# Altium schematic sheet peripheral.SchDoc
size A
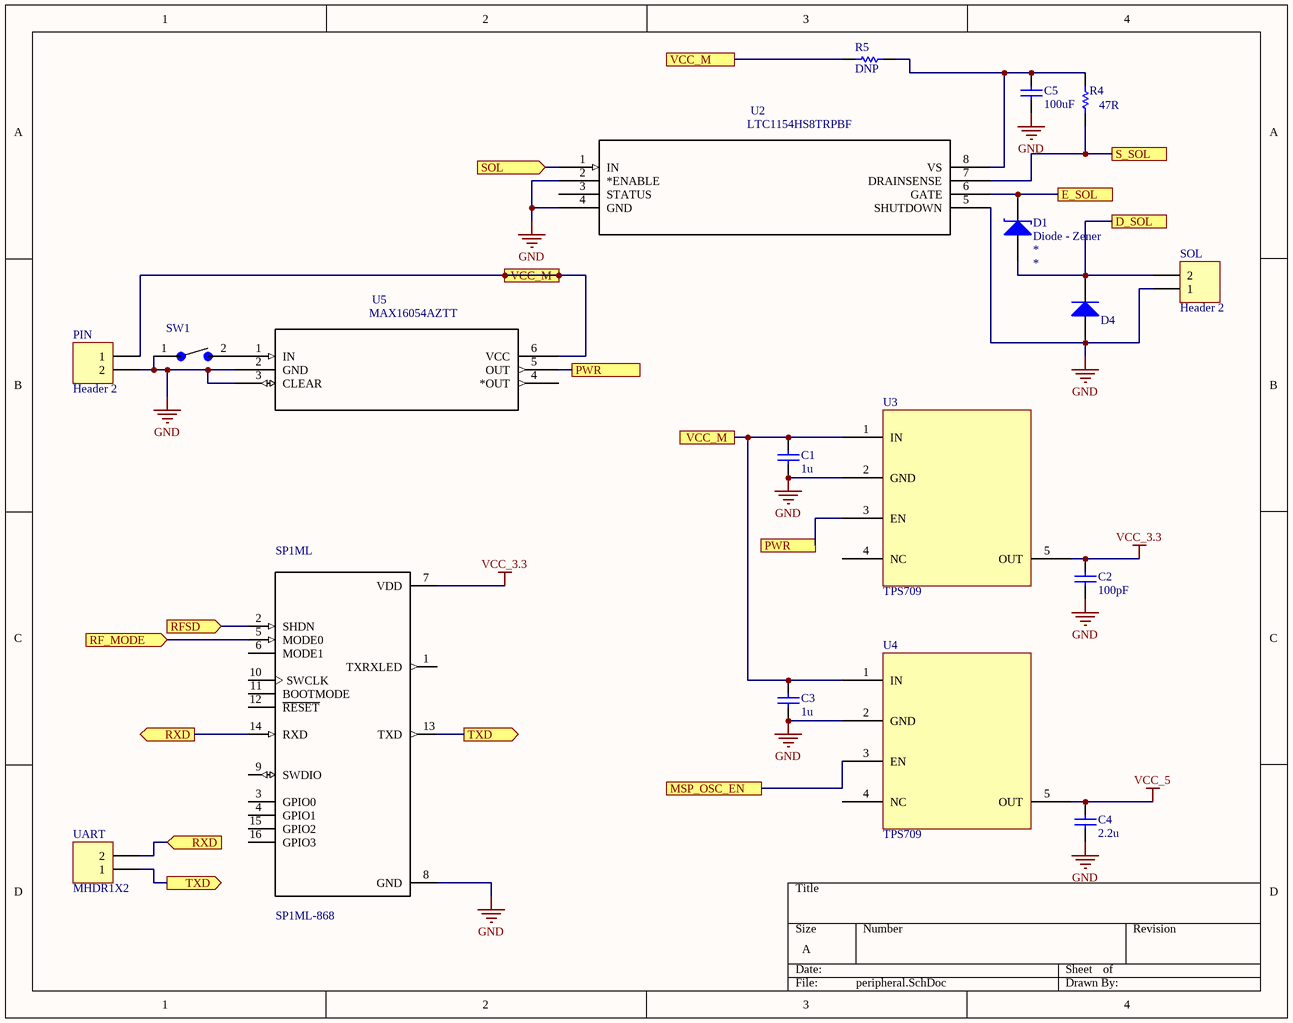
[diagram p0: peripheral.SchDoc]

## Parts
C1  value 1u  [0402-W]  (hidden comment: Cap)
C2  value 100pF  [0402-W]  (hidden comment: Cap)
C3  value 1u  [0402-W]  (hidden comment: Cap)
C4  value 2.2u  [0402-W]  (hidden comment: Cap)
C5  value 100uF  [0402-W]  (hidden comment: Cap)
D1  Diode - Zener  [SOD-523]
D4  Diode  [DIODE - SOD123]  (value not drawn)
PIN  Header 2  [HDR1X2]
R4  value 47R  [0402]  (hidden comment: R_Pullup_1)
R5  value DNP  [0402]  (hidden comment: R_Pullup_1)
SOL  Header 2  [HDR1X2]
SP1ML  SP1ML-868  [STM_SP1ML-868]
SW1  FSMSM _1437566-3_  [TE_FSMSM]  (value not drawn)
U2  LTC1154HS8TRPBF  [SOIC-8_S]
U3  TPS709  [SOT95P280X145-5N]
U4  TPS709  [SOT95P280X145-5N]
U5  MAX16054AZTT  [21-0114C]
UART  MHDR1X2  [MHDR1X2]

## Ports
D_SOL, E_SOL, MSP_OSC_EN, PWR, RF_MODE (in), RFSD (in), RXD (in), RXD (out), S_SOL, SOL (in), TXD (out), VCC_M

## Nets
GND: C1.1 C2.1 C3.1 C4.1 C5.1 D4.1(A) PIN.2 SOL.1 SP1ML.8(GND) SW1.1 U2.2(*ENABLE) U2.4(GND) U2.5(SHUTDOWN) U3.2(GND) U4.2(GND) U5.2(GND) U5.3(CLEAR)
VCC_3.3: C2.2 SP1ML.7(VDD) U3.5(OUT)
VCC_5: C4.2 U4.5(OUT)
D_SOL: D1.1(A) D4.2(C) SOL.2 ; port D_SOL
E_SOL: D1.2(K) U2.6(GATE) ; port E_SOL
MSP_OSC_EN: U4.3(EN) ; port MSP_OSC_EN
PWR: U3.3(EN) U5.5(OUT) ; port PWR
RF_MODE: SP1ML.5(MODE0) ; port RF_MODE
RFSD: SP1ML.2(SHDN) ; port RFSD
RXD: SP1ML.14(RXD) UART.2 ; port RXD
S_SOL: R4.1 U2.7(DRAINSENSE) ; port S_SOL
SOL: U2.1(IN) ; port SOL
TXD: SP1ML.13(TXD) UART.1 ; port TXD
VCC_M: C1.2 C3.2 PIN.1 R5.2 U3.1(IN) U4.1(IN) U5.6(VCC) ; port VCC_M
NetC5_2: C5.2 R4.2 R5.1 U2.8(VS)
NetSW1_2: SW1.2 U5.1(IN)

Not connected (* = marked no-connect by the designer): SP1ML 1(TXRXLED) 3(GPIO0) 4(GPIO1) 6(MODE1) 9(SWDIO) 10(SWCLK) 11(BOOTMODE) 12(~{RESET}) 15(GPIO2) 16(GPIO3); U2 3(STATUS); U3 4(NC); U4 4(NC); U5 4(*OUT)

## Library data of the parts
C1-C5 = Cap: Ceramic Capacitor (Surface Mount); Manufacturer: Generic Ceramic Chip Cap (TBD); Digi-Key Part Number: *; Manufacturer Part Number: *; Note: *; Rating: *
D4 = Diode: General Purpose Diode; Manufacturer: *; Manufacturer Part Number: *; Digi-Key Part Number: *; Value: *; Rating: *; Note: *
PIN SOL = Header 2: Header, 2-Pin; LatestRevisionDate: 17-Jul-2002; LatestRevisionNote: Re-released for DXP Platform.; Publisher: Altium Limited
R4 R5 = Res: Chip Resistor (Surface Mount); Manufacturer: Generic Chip Res (TBD); Manufacturer Part Number: *; Digi-Key Part Number: *; Rating: *; Comment_1: Res
SP1ML = SP1ML-868: RF TXRX MODULE ISM<1GHZ CHIP ANT; MF: STMicroelectronics; Availability: Good; MP: SP1ML-868; Price: 16.88 USD; Package: SMD-16 STMicroelectronics; Value: *
SW1 = FSMSM: FSMSM=3.5X6 SMT TACT; MF: TE Connectivity; Price: None; SnapEDA_Link: https://www.snapeda.com/parts/FSMSM/TE%20Connectivity%20/%20DEUTSCH/view-part/?ref=snap; MP: FSMSM; Availability: Unavailable; Package: None; Value: *
U2 = LTC1154HS8TRPBF: IC MOSFET DRIVER HIGH-SIDE 8SOIC; MF: Linear Technology; MP: LTC1154HS8#TRPBF; Price: 2.92 USD; Package: SOIC-8 Linear Technology; Availability: Unavailable; Value: *
U3 U4 = TPS709: Ultra low power Voltage Regulator
U5 = MAX16054AZTT: On/Off Controller With Debounce And +/-1; MF: Maxim Integrated; MP: MAX16054AZT+; SnapEDA_Link: https://www.snapeda.com/parts/MAX16054AZT%2B/Maxim%20Integrated/view-part/?ref=snap; Package: TSOT-23 Maxim Integrated; Price: 2.94 USD; Availability: Unavailable; Value: *
UART = MHDR1X2: Header, 2-Pin; LatestRevisionDate: 17-Jul-2002; LatestRevisionNote: Re-released for DXP Platform.; Publisher: Altium Limited
D1 = Diode - Zener: Manufacturer Part Number: *; Manufacturer: *; Digi-Key Part Number: *; Note: *; Value: *; Rating: *